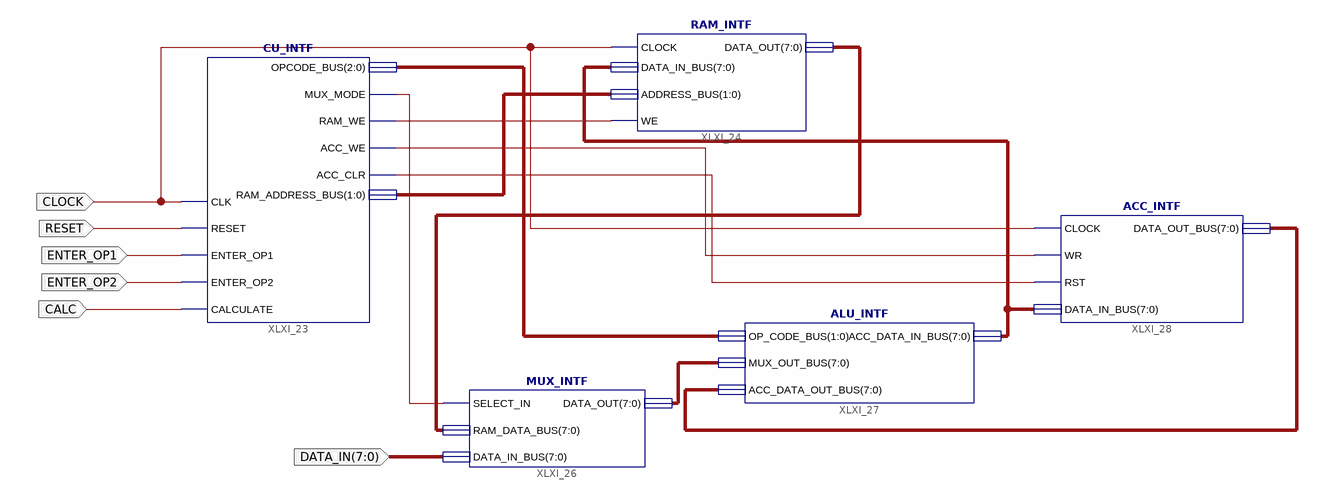
[diagram p0: schematic sheet 1]
// Xilinx ISE schematic COMPLITE_MACHINE.sch (spartan3a) as structural Verilog: 5 symbols, 6 ports
module COMPLITE_MACHINE (
  input  [7:0] DATA_IN,
  input  CALC,
  input  ENTER_OP2,
  input  ENTER_OP1,
  input  RESET,
  input  CLOCK
);

  wire XLXN_54, XLXN_61, XLXN_73, XLXN_74;
  wire [1:0] XLXN_55;
  wire [2:0] XLXN_66;
  wire [7:0] XLXN_63, XLXN_64, XLXN_72, XLXN_78;

  CU_INTF XLXI_23 (
    .RESET(RESET), .ENTER_OP1(ENTER_OP1), .ENTER_OP2(ENTER_OP2), .CALCULATE(CALC), .RAM_WE(XLXN_54),
    .ACC_WE(XLXN_74), .ACC_CLR(XLXN_73), .MUX_MODE(XLXN_61), .OPCODE_BUS(XLXN_66), .CLK(CLOCK),
    .RAM_ADDRESS_BUS(XLXN_55));
  RAM_INTF XLXI_24 (.CLOCK(CLOCK), .DATA_OUT(XLXN_63), .DATA_IN_BUS(XLXN_72), .ADDRESS_BUS(XLXN_55), .WE(XLXN_54));
  MUX_INTF XLXI_26 (.RAM_DATA_BUS(XLXN_63), .DATA_OUT(XLXN_64), .SELECT_IN(XLXN_61), .DATA_IN_BUS(DATA_IN));
  ALU_INTF XLXI_27 (
    .OP_CODE_BUS(XLXN_66), .MUX_OUT_BUS(XLXN_64), .ACC_DATA_OUT_BUS(XLXN_78), .ACC_DATA_IN_BUS(XLXN_72));
  ACC_INTF XLXI_28 (.CLOCK(CLOCK), .WR(XLXN_74), .RST(XLXN_73), .DATA_IN_BUS(XLXN_72), .DATA_OUT_BUS(XLXN_78));
endmodule
